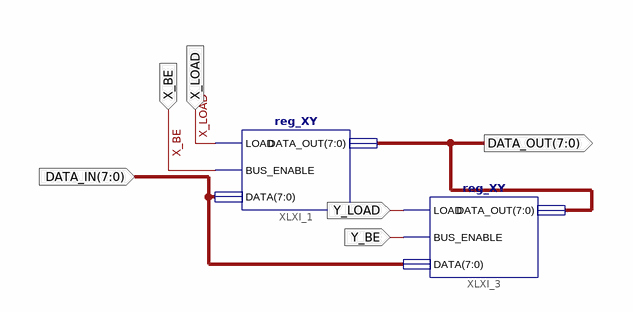
[diagram p0: schematic sheet 1]
// Xilinx ISE schematic test.sch (spartan6) as structural Verilog: 2 symbols, 6 ports
module test (
  input  X_LOAD,
  input  X_BE,
  input  [7:0] DATA_IN,
  input  Y_BE,
  input  Y_LOAD,
  output [7:0] DATA_OUT
);

  reg_XY XLXI_1 (.LOAD(X_LOAD), .BUS_ENABLE(X_BE), .DATA(DATA_IN), .DATA_OUT(DATA_OUT));
  reg_XY XLXI_3 (.LOAD(Y_LOAD), .BUS_ENABLE(Y_BE), .DATA(DATA_IN), .DATA_OUT(DATA_OUT));
endmodule
